# EAGLE schematic msx_rom (EAGLE 7.6.0)
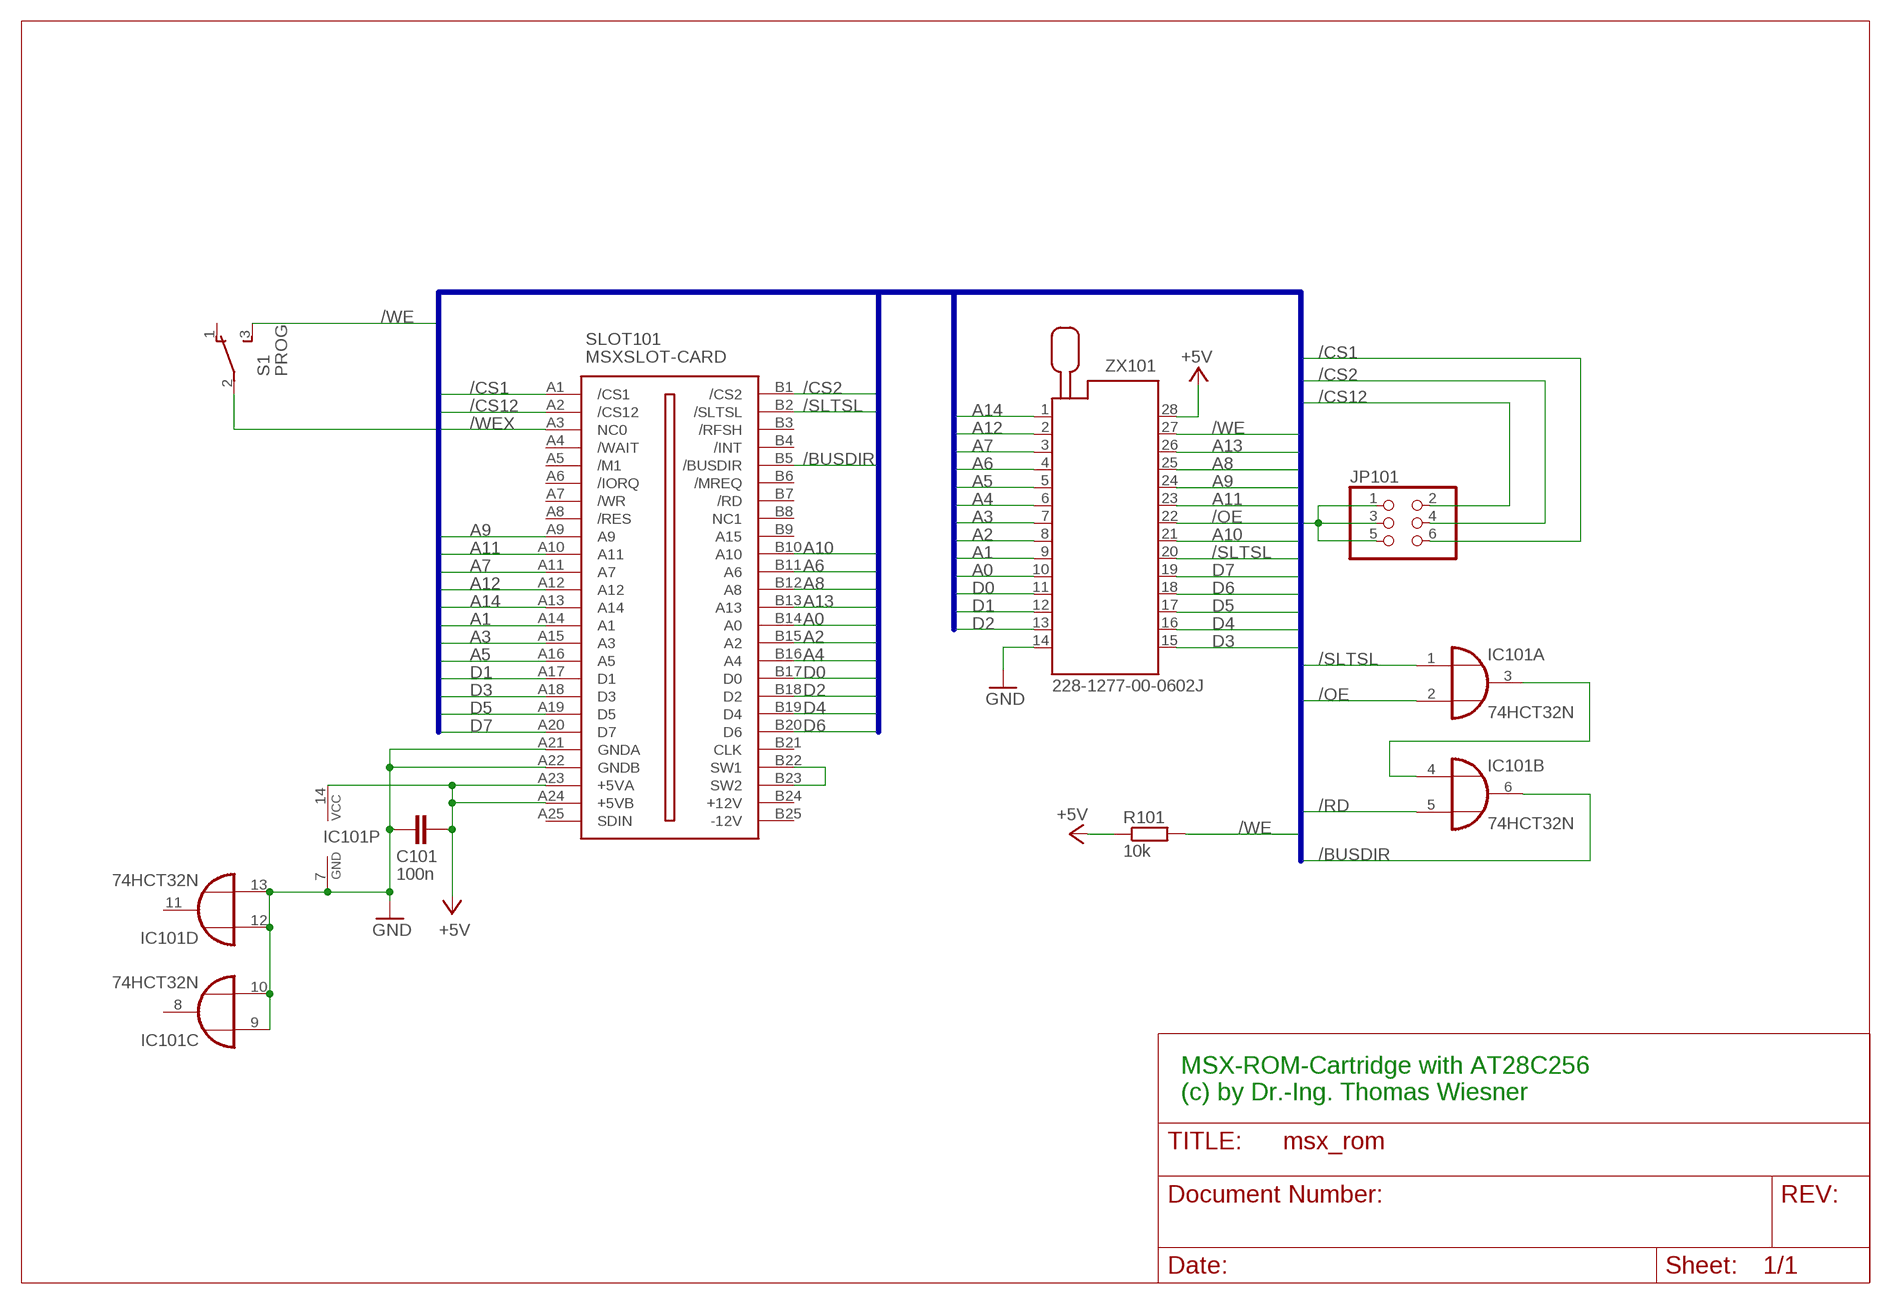
[diagram p0: schematic, sheet 1]

## Parts
C101  100n  C-EU025-025X050  [C025-025X050]
IC101  74HCT32N  [DIL14]
JP101  PINHD-2X3  [2X03]
R101  10k  R-EU_0207/10  [0207/10]
S1  PROG  TL36PO  [TL3XPO]
SLOT101  MSXSLOT-CARD  [MSXCARD]
ZX101  228-1277-00-0602J  [228-1277-00-0602J]

## Nets
+5V: C101.2 IC101.14(P:VCC) R101.1 SLOT101.A23(+5VA) SLOT101.A24(+5VB) ZX101.28
/BUSDIR: IC101.6(B:O) SLOT101.B5(/BUSDIR)
/CS1: JP101.6 SLOT101.A1(/CS1)
/CS2: JP101.4 SLOT101.B1(/CS2)
/CS12: JP101.2 SLOT101.A2(/CS12)
/OE: IC101.2(A:I1) JP101.1 JP101.3 JP101.5 ZX101.22
/RD: IC101.5(B:I1)
/SLTSL: IC101.1(A:I0) SLOT101.B2(/SLTSL) ZX101.20
/WE: R101.2 S1.3(S) ZX101.27
/WEX: S1.2(P) SLOT101.A3(NC0)
A0: SLOT101.B14(A0) ZX101.10
A1: SLOT101.A14(A1) ZX101.9
A2: SLOT101.B15(A2) ZX101.8
A3: SLOT101.A15(A3) ZX101.7
A4: SLOT101.B16(A4) ZX101.6
A5: SLOT101.A16(A5) ZX101.5
A6: SLOT101.B11(A6) ZX101.4
A7: SLOT101.A11(A7) ZX101.3
A8: SLOT101.B12(A8) ZX101.25
A9: SLOT101.A9 ZX101.24
A10: SLOT101.B10(A10) ZX101.21
A11: SLOT101.A10(A11) ZX101.23
A12: SLOT101.A12 ZX101.2
A13: SLOT101.B13(A13) ZX101.26
A14: SLOT101.A13(A14) ZX101.1
D0: SLOT101.B17(D0) ZX101.11
D1: SLOT101.A17(D1) ZX101.12
D2: SLOT101.B18(D2) ZX101.13
D3: SLOT101.A18(D3) ZX101.15
D4: SLOT101.B19(D4) ZX101.16
D5: SLOT101.A19(D5) ZX101.17
D6: SLOT101.B20(D6) ZX101.18
D7: SLOT101.A20(D7) ZX101.19
GND: C101.1 IC101.7(P:GND) IC101.9(C:I0) IC101.10(C:I1) IC101.12(D:I0) IC101.13(D:I1) SLOT101.A21(GNDA) SLOT101.A22(GNDB) ZX101.14
N$3: IC101.3(A:O) IC101.4(B:I0)
N$28: SLOT101.B22(SW1) SLOT101.B23(SW2)
Unconnected: IC101.8(C:O) IC101.11(D:O) S1.1(O) SLOT101.A4(/WAIT) SLOT101.A5(/M1) SLOT101.A6(/IORQ) SLOT101.A7(/WR) SLOT101.A8(/RES) SLOT101.A25(SDIN) SLOT101.B3(/RFSH) SLOT101.B4(/INT) SLOT101.B6(/MREQ) SLOT101.B7(/RD) SLOT101.B8(NC1) SLOT101.B9(A15) SLOT101.B21(CLK) SLOT101.B24(+12V) SLOT101.B25(-12V)

## Buses
B$1

## Notes on the sheet
- MSX-ROM-Cartridge with AT28C256
  (c) by Dr.-Ing. Thomas Wiesner

## Library data of the parts
C101 = rcl:C-EU: CAPACITOR, European symbol
IC101 = 74xx-eu:74*32: Quad 2-input OR gate
JP101 = pinhead:PINHD-2X3: PIN HEADER
R101 = rcl:R-EU_: RESISTOR, European symbol
S1 = switch:TL36PO: TINY SWITCH ON - ON Source: http://www2.produktinfo.conrad.com/datenblaetter/700000-724999/705152-da-01-de-Subminiaturschalter_TL_36YO.pdf
SLOT101 = mbc:MSXSLOT: MSX-Slot-Verbinder
ZX101 = con-3m:228-?00-0602J: Zero Insertion Force Socked Source: http://www.3M.com/ehpd; MF: 3M; MPN: 228-1277-00-0602J; OC_FARNELL: 9897356; OC_NEWARK: 85K7825